# EAGLE design LSM6DS3_Breakout (EAGLE 7.1.0)
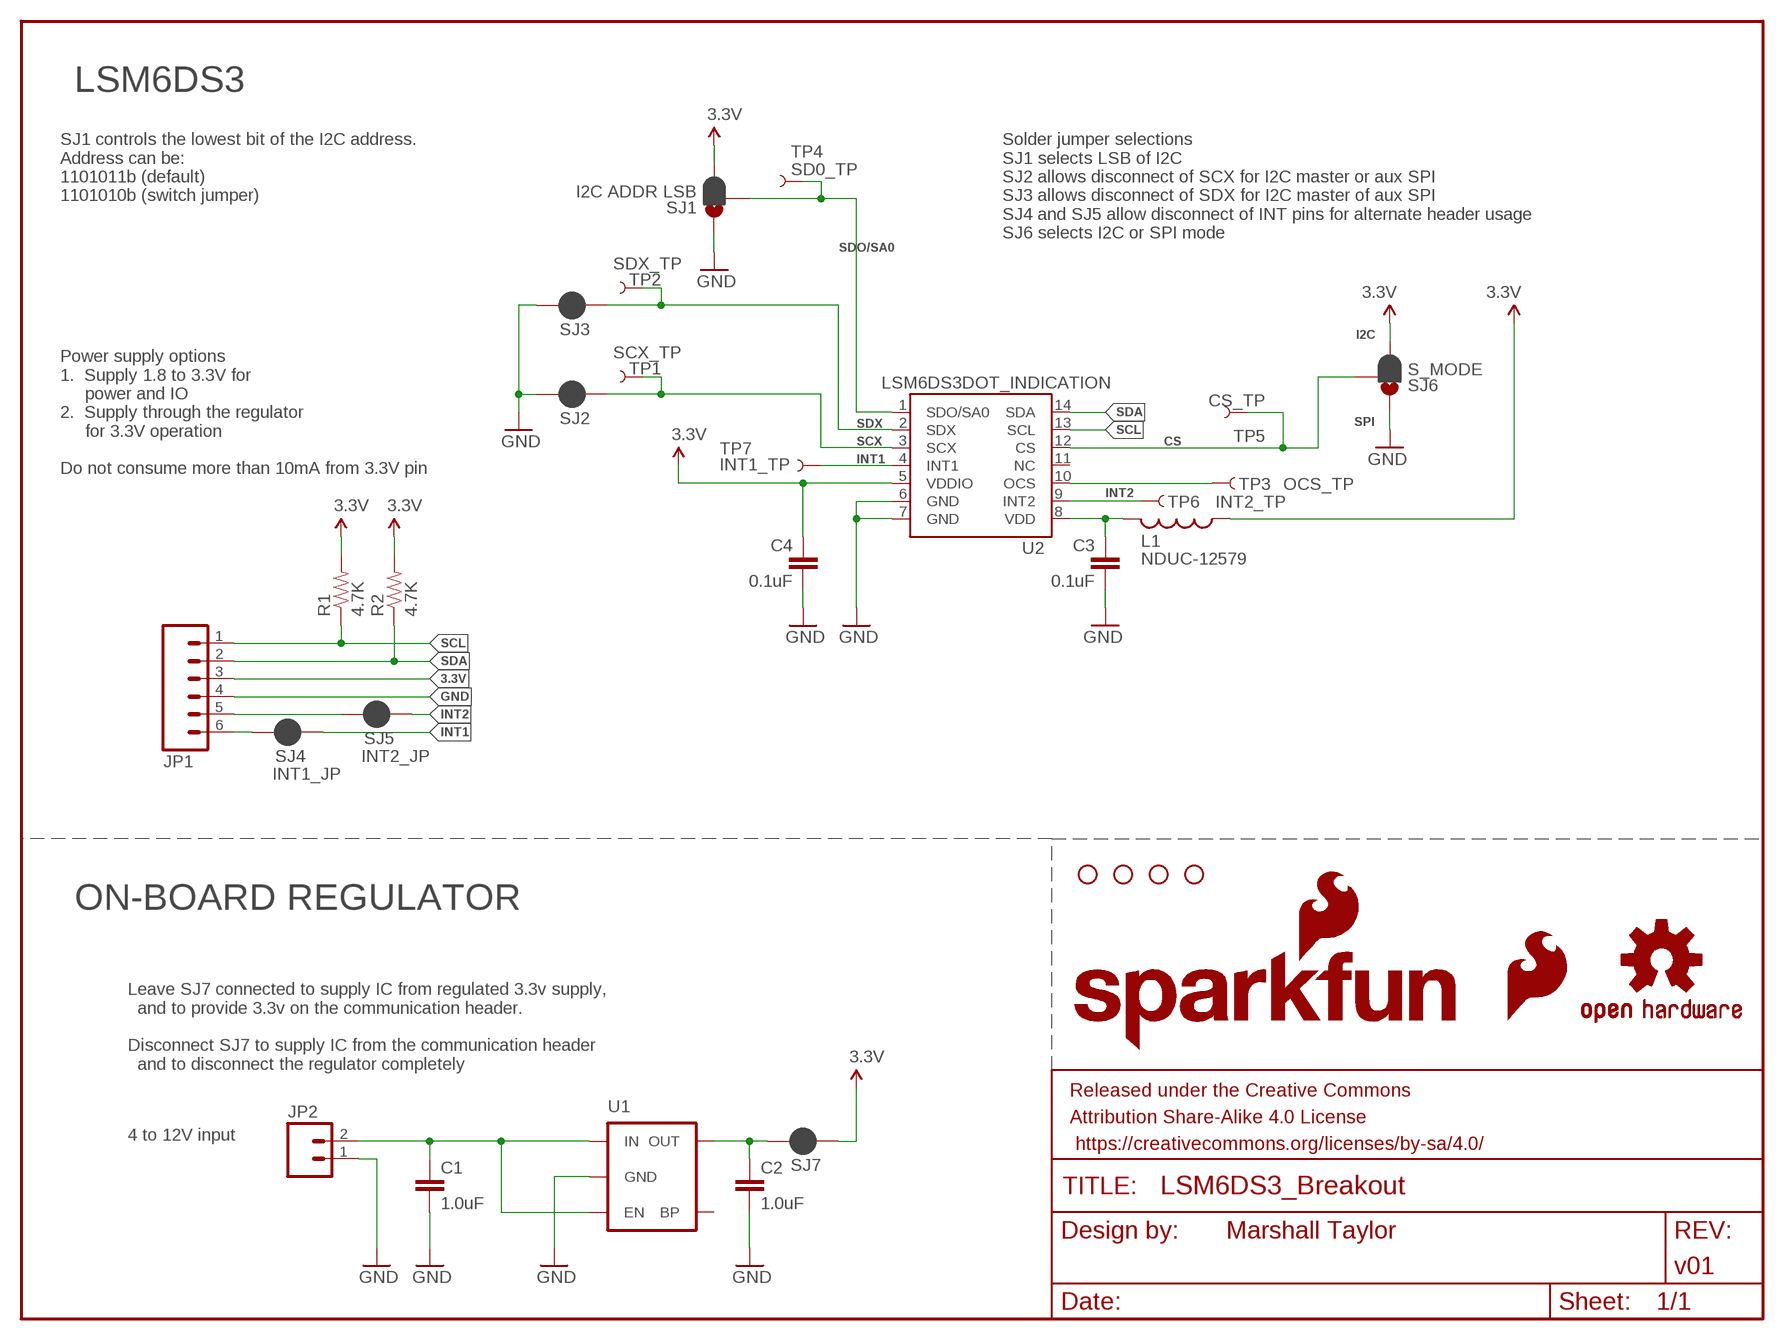
[diagram p0: schematic, sheet 1]

## Parts
C1  1.0uF  1.0UF-16V-10%(0603)  [0603-CAP]
C2  1.0uF  1.0UF-16V-10%(0603)  [0603-CAP]
C3  0.1uF  0.1UF-100V-10%(0603)  [0603-CAP]
C4  0.1uF  0.1UF-100V-10%(0603)  [0603-CAP]
FRAME1  FRAME-LETTER  [CREATIVE_COMMONS]
JP1  M06SILK_FEMALE_PTH  [1X06]
JP2  M02PTH  [1X02]
L1  NDUC-12579  INDUCTOR0603  [0603]
LOGO1  SFE_LOGO_NAME_FLAME.1_INCH  [SFE_LOGO_NAME_FLAME_.1]
LOGO2  OSHW-LOGOS  [OSHW-LOGO-S]
LOGO3  SFE_LOGO_FLAME.4_INCH  [SFE_LOGO_FLAME_.4]
R1  4.7K  4.7KOHM-1/10W-1%(0603)  [0603-RES]
R2  4.7K  4.7KOHM-1/10W-1%(0603)  [0603-RES]
SJ1  I2C ADDR LSB  JUMPER-PAD-3-2OF3_NC_BY_PASTE  [PAD-JUMPER-3-2OF3_NC_BY_PASTE_YES_SILK_FULL_BOX]
SJ2  JUMPER-PAD-2-NC_BY_PASTE  [PAD-JUMPER-2-NC_BY_PASTE_YES_SILK]
SJ3  JUMPER-PAD-2-NC_BY_PASTE  [PAD-JUMPER-2-NC_BY_PASTE_YES_SILK]
SJ4  INT1_JP  JUMPER-PAD-2-NC_BY_PASTE  [PAD-JUMPER-2-NC_BY_PASTE_YES_SILK]
SJ5  INT2_JP  JUMPER-PAD-2-NC_BY_PASTE  [PAD-JUMPER-2-NC_BY_PASTE_YES_SILK]
SJ6  S_MODE  JUMPER-PAD-3-2OF3_NC_BY_PASTE  [PAD-JUMPER-3-2OF3_NC_BY_PASTE_YES_SILK_FULL_BOX]
SJ7  JUMPER-PAD-2-NC_BY_PASTE  [PAD-JUMPER-2-NC_BY_PASTE_YES_SILK]
STANDOFF1  STAND-OFF  [STAND-OFF]
STANDOFF2  STAND-OFF  [STAND-OFF]
STANDOFF3  STAND-OFF  [STAND-OFF]
STANDOFF4  STAND-OFF  [STAND-OFF]
TP1  SCX_TP  TEST-POINTTP_15TH_THRU  [TP_15TH]
TP2  SDX_TP  TEST-POINTTP_15TH_THRU  [TP_15TH]
TP3  OCS_TP  TEST-POINTTP_15TH_THRU  [TP_15TH]
TP4  SD0_TP  TEST-POINTTP_15TH_THRU  [TP_15TH]
TP5  CS_TP  TEST-POINTTP_15TH_THRU  [TP_15TH]
TP6  INT2_TP  TEST-POINTTP_15TH_THRU  [TP_15TH]
TP7  INT1_TP  TEST-POINTTP_15TH_THRU  [TP_15TH]
U1  MIC52053.3V  [SOT23-5]
U2  LSM6DS3DOT_INDICATION  [LGA14L_DOT_INDICATOR]

## Nets
3.3V: C4.1 JP1.3 L1.1 R1.2 R2.2 SJ1.3 SJ6.3 SJ7.1 U2.5(VDDIO)
CS: SJ6.2 TP5.P$1 U2.12(CS)
GND: C1.2 C2.2 C3.2 C4.2 JP1.4 JP2.1 SJ1.1 SJ2.2 SJ3.2 SJ6.1 U1.2(GND) U2.6(GND) U2.7(GND)
INT1: SJ4.1 TP7.P$1 U2.4(INT1)
INT2: SJ5.1 TP6.P$1 U2.9(INT2)
N$1: C3.1 L1.2 U2.8(VDD)
N$2: TP3.P$1 U2.10(OCS)
N$3: JP1.5 SJ5.2
N$4: JP1.6 SJ4.2
N$5: C1.1 JP2.2 U1.1(IN) U1.3(EN)
N$6: C2.1 SJ7.2 U1.5(OUT)
SCL: JP1.1 R1.1 U2.13(SCL)
SCX: SJ2.1 TP1.P$1 U2.3(SCX)
SDA: JP1.2 R2.1 U2.14(SDA)
SDO/SA0: SJ1.2 TP4.P$1 U2.1(SDO/SA0)
SDX: SJ3.1 TP2.P$1 U2.2(SDX)
Unconnected: U1.4(BP) U2.11(NC)

## Notes on the sheet
- LSM6DS3
- SJ1 controls the lowest bit of the I2C address.
  Address can be:
  1101011b (default)
  1101010b (switch jumper)
- Solder jumper selections
  SJ1 selects LSB of I2C
  SJ2 allows disconnect of SCX for I2C master or aux SPI
  SJ3 allows disconnect of SDX for I2C master of aux SPI
  SJ4 and SJ5 allow disconnect of INT pins for alternate header usage
  SJ6 selects I2C or SPI mode
- I2C
- SPI
- Power supply options
  1.  Supply 1.8 to 3.3V for
       power and IO
  2.  Supply through the regulator
       for 3.3V operation
- Do not consume more than 10mA from 3.3V pin
- ON-BOARD REGULATOR
- Leave SJ7 connected to supply IC from regulated 3.3v supply,
    and to provide 3.3v on the communication header.
  
  Disconnect SJ7 to supply IC from the communication header
    and to disconnect the regulator completely
- 4 to 12V input

## Library data of the parts
C1 C2 = SparkFun-Capacitors:1.0UF-16V-10%(0603): CAP-00868; PROD_ID: CAP-00868
C3 C4 = SparkFun-Capacitors:0.1UF-100V-10%(0603): CAP-08390; PROD_ID: CAP-08390
FRAME1 = SparkFun-Aesthetics:FRAME-LETTER: Schematic Frame Standard 8.5x11 US Letter frame; DESIGNER: Marshall Taylor; VERSION: v01
JP1 = SparkFun-Connectors:M06: Header 6 Standard 6-pin 0.1" header. Use with straight break away headers (SKU : PRT-00116), right angle break away headers (PRT-00553), swiss pins (PRT-00743), machine pins (PRT-00117), and female headers (PRT-00115). Molex polarized connector foot print use with SKU : PRT-08094 with associated crimp pins and housings. NOTES ON THE VARIANTS LOCK and LOCK_LONGPADS... This footprint was designed to help hold the alignment of a through-hole component (i.e. 6-pin header) while soldering it into place. You may notice that each hole has been shifted either up or down by 0.005 of an inch from it's more standard position (which is a perfectly straight line). This slight alteration caused the pins (the squares in the middle) to touch the edges of the holes. Because they are alternating, it causes a "brace" to hold the component in place. 0.005 has proven to be the perfect amount of "off-center" position when using our standard breakaway headers. Although looks a little odd when you look at the bare footprint, once you have a header in there, the alteration is very hard to notice. Also,if you push a header all the way into place, it is covered up entirely on the bottom side. This idea of altering the position of holes to aid alignment will be further integrated into the Sparkfun Library for other footprints. It can help hold any component with 3 or more connection pins.; PROD_ID: CONN-08437
JP2 = SparkFun-Connectors:M02: Standard 2-pin 0.1" header. Use with - straight break away headers ( PRT-00116) - right angle break away headers (PRT-00553) - swiss pins (PRT-00743) - machine pins (PRT-00117) - female headers (PRT-00115) Molex polarized connector foot print use with: PRT-08233 with associated crimp pins and housings. 2.54_SCREWTERM for use with PRT-10571. 3.5mm Screw Terminal footprints for PRT-08084 5mm Screw Terminal footprints for use with PRT-08432
L1 = SparkFun-Passives:INDUCTOR: Inductors Basic Inductor/Choke - 0603 and 1206. Footprints are not proven and vary greatly between part numbers. SRN6045- 33uH, 20% 1.4A SDR0403-560KL - 56uH, 10%, 500mA RMS/740mA peak
LOGO1 = SparkFun-Aesthetics:SFE_LOGO_NAME_FLAME: SFE Logo, name and flame This is the SparkFun full logo. The logo on the schematic will always be the same size; the package variant is the height of the flame part of the logo. Default layer for the logo on the board is tSilk.
LOGO2 = SparkFun-Aesthetics:OSHW-LOGO: Open Source Hardware Logo This logo indicates the piece of hardware it is found on incorporates a OSHW license and/or adheres to the definition of open source hardware found here: http://freedomdefined.org/OSHW
LOGO3 = SparkFun-Aesthetics:SFE_LOGO_FLAME: SFE Logo, flame only This is the SparkFun flame logo. The logo on the schematic will always be the same size; the package variant is the height of the flame. Default layer for the logo on the board is tSilk.
R1 R2 = SparkFun-Resistors:4.7KOHM-1/10W-1%(0603): RES-07857; PROD_ID: RES-07857
SJ1 SJ6 = SparkFun-Passives:JUMPER-PAD-3-2OF3_NC_BY_PASTE
SJ2-SJ5 SJ7 = SparkFun-Passives:JUMPER-PAD-2-NC_BY_PASTE
STANDOFF1-STANDOFF4 = SparkFun-Electromechanical:STAND-OFF: #4 Stand Off This is the mechanical footprint for a #4 phillips button head screw. Use the keepout ring to avoid running the screw head into surrounding components. SKU : PRT-00447
TP1-TP7 = SparkFun-Passives:TEST-POINT: Bare copper test points for troubleshooting or ICT
U1 = SparkFun-PowerIC:MIC5205: MIC5205 150mA vreg 3.3V - VREG-00822 5V - VREG-00823; PROD_ID: VREG-00822
U2 = LSM6DS3:LSM6DS3

## Board
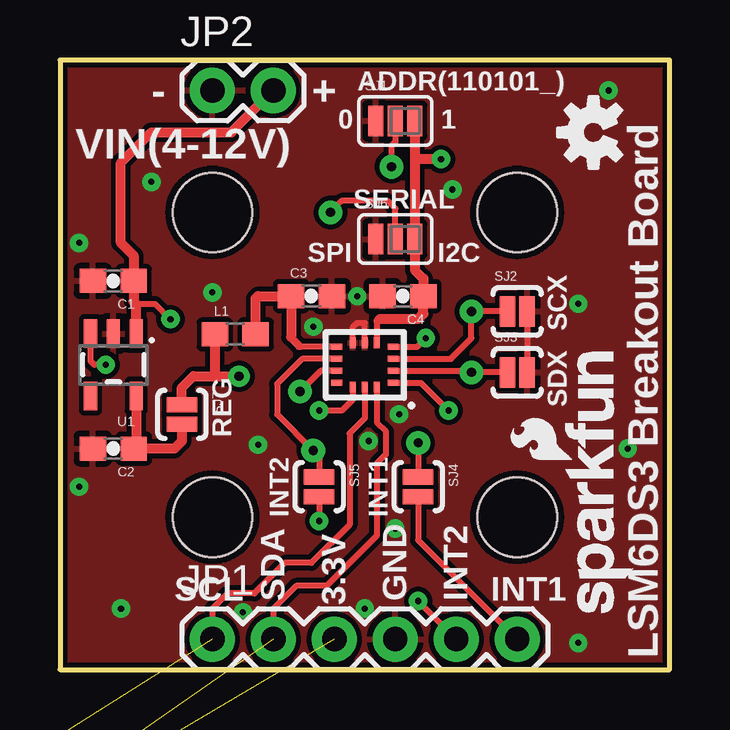
[diagram p1: board, top side]
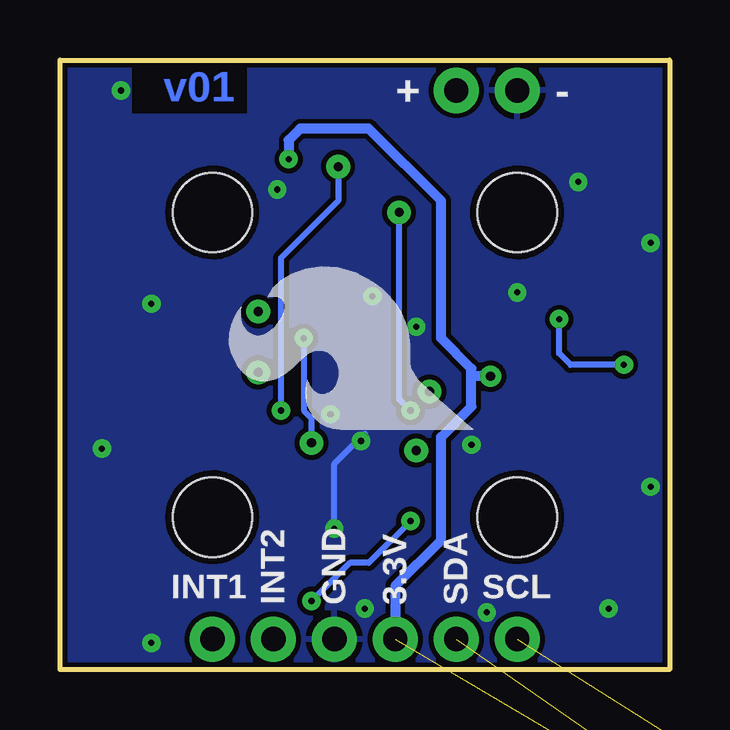
[diagram p2: board, bottom side, seen from below]

Size 25.4 x 25.4 mm. Coordinates in mm from the lower left corner, seen from the top.
Outline: 25.4,25.4 0,25.4 0,0 25.4,0 25.4,25.4
Copper layers (1*16): Top 0.035mm / dielectric 1.5mm / Bottom 0.035mm
Design rules "SparkFun-2-layer": minimum track width 7mil, minimum drill 15mil, track to track 8mil, track to pad 8mil, pad to pad 8mil, via to via 8mil, smd to smd 8mil, copper to edge 8mil, drill to drill 8mil, minimum pad ring 12mil, minimum via ring 10mil, stop-mask expansion 4mil, vias tented up to drill 20mil, thermal gap 10mil
bRestrict: area 17.6,23.2 to 22.4,25.4

### Footprints (pad centres in the part's own frame; a part is rotated, then mirrored left to right if it is on the bottom)
0603-CAP = smd 1.1 x 1: 1 -0.85,0; 2 0.85,0
1X06 = drill 1.016 pad 1.88: 1 0,0; 2 2.54,0; 3 5.08,0; 4 7.62,0; 5 10.16,0; 6 12.7,0
1X02 = drill 1.016 pad 1.88: 1 0,0; 2 2.54,0
0603 = smd 1.1 x 1: 1 -0.85,0; 2 0.85,0
0603-RES = smd 1.1 x 1: 1 -0.85,0; 2 0.85,0
PAD-JUMPER-3-2OF3_NC_BY_PASTE_YES_SILK_FULL_BOX = smd 0.635 x 1.27: 1 -0.813,0; 2 0,0; 3 0.813,0
PAD-JUMPER-2-NC_BY_PASTE_YES_SILK = smd 0.635 x 1.27: 1 -0.401,0; 2 0.413,0
STAND-OFF = hole 3.302: 0,0
TP_15TH = drill 0.381 pad 0.61: P$1 0,0
SOT23-5 = smd 0.55 x 1.2: 1 -0.95,-1.3; 2 0,-1.3; 3 0.95,-1.3; 4 0.95,1.3; 5 -0.95,1.3
LGA14L_DOT_INDICATOR = smd 0.45 x 0.25: 1 -1.175,0.75; 2 -1.175,0.25; 3 -1.175,-0.25; 4 -1.175,-0.75; 8 1.175,-0.75; 9 1.175,-0.25; 10 1.175,0.25; 11 1.175,0.75 | smd 0.25 x 0.45: 5 -0.5,-0.925; 6 0,-0.925; 7 0.5,-0.925; 12 0.5,0.925; 13 0,0.925; 14 -0.5,0.925

### Placement (x,y rotation side)
C1  2.22,16.19 180 top
C2  2.22,9.21 180 top
C3  10.48,15.56 0 top
C4  14.29,15.56 180 top
FRAME1  -24.13,-26.67 0 top  (outside the outline)
JP1  6.35,1.27 0 top
JP2  6.35,24.13 0 top
L1  7.3,13.97 0 top
LOGO1  23.97,1.91 90 top
LOGO2  22.23,22.38 90 top
LOGO3  7.62,9.37 90 bottom
R1  -43.18,-30.48 0 top  (outside the outline)
R2  -43.18,-35.56 0 top  (outside the outline)
SJ1  13.97,22.86 0 top
SJ2  19.05,14.92 0 top
SJ3  19.05,12.38 0 top
SJ4  14.92,7.62 270 top
SJ5  10.79,7.62 270 top
SJ6  13.97,17.94 0 top
SJ7  5.08,10.64 270 top
STANDOFF1  6.35,19.05 0 top
STANDOFF2  6.35,6.35 0 top
STANDOFF3  19.05,19.05 0 top
STANDOFF4  19.05,6.35 0 top
TP1  17.14,14.92 180 top
TP2  17.14,12.38 180 top
TP3  10,11.59 180 top
TP4  13.81,20.95 0 top
TP5  11.27,19.05 0 top
TP6  10.56,9.13 180 top
TP7  14.92,9.45 180 top
U1  2.22,12.7 180 top
U2  12.7,12.7 180 top

### Tracks (layer width: path | path; a pad name or v marks a point on that pad's centre or on a via)
3.3V  (via drill 0.25, 0.38)  (2 unrouted)
  Top 0.254: 13.2,14.47 13.34,14.61 | 13.2,14.47 U2.5 | 13.2,14.47 13.2,14.58 13.3,14.68 13.48,14.68 13.51,14.65
  Top 0.406: 13.34,14.61 14.92,14.61 15.14,14.82 C4.1 15.14,16.3 14.78,16.65 SJ6.3 14.78,21.27 | SJ1.3 14.78,21.27 | v15.88,21.27 14.78,21.27 | SJ7.1 5.08,11.75 5.56,12.22 6.51,12.22 | 6.51,12.22 v7.46,12.22 | L1.1 6.45,12.28 6.51,12.22
  Bottom 0.406: JP1.3 11.43,3.49 9.53,5.4 9.53,9.68 8.26,10.95 8.26,12.22 | v15.88,21.27 15.88,22.07 15.4,22.54 12.54,22.54 9.53,19.53 9.53,13.81 8.26,12.54 8.26,12.22 | v7.46,12.22 8.26,12.22
CS  (via drill 0.25)
  Top 0.254: U2.12 12.2,11.25 11.75,10.79 v10.79,10.79 | SJ6.2 13.97,19.21 13.65,19.53 11.75,19.53 TP5.P$1
  Bottom 0.254: v10.79,10.79 11.27,11.27 TP5.P$1
GND  (via drill 0.25)
  Top 0.254: SJ2.2 SJ3.2 | U2.6 12.7,14.45 12.38,14.45 12.2,14.26 U2.7
  Bottom 0.254: v13.97,5.87 13.97,8.57 12.7,9.84
  other vias: 12.86,9.53 7.62,2.38 14.13,10.64 12.38,15.56 0.79,7.62 16.35,20 22.86,24.13 21.59,1.11 21.59,15.24 12.7,2.54 3.81,20.32 6.35,15.72 8.26,9.37 2.54,2.54 10.56,14.29 23.65,9.21 0.79,17.78
  pour Bottom: 25.4,0 25.4,25.4 0,25.4 0,0
  pour Top: 25.4,0 25.4,25.4 0,25.4 0,0
INT1  (via drill 0.25)
  Top 0.254: U2.4 14.88,13.45 v15.24,13.81 | TP7.P$1 SJ4.1
  Bottom 0.254: v15.24,13.81 15.24,10.79 14.92,10.48 TP7.P$1
INT2
  Top 0.254: U2.9 10.09,12.95 9.05,11.91 9.05,10.64 TP6.P$1 10.79,8.89 SJ5.1
N$1
  Top 0.254: U2.8 10.04,13.45 | 9.63,13.87 10.04,13.45 | 10.04,13.45 9.97,13.45 | 9.97,13.45 9.6,13.81 | 9.97,13.45 9.94,13.45 9.55,13.84
  Top 0.406: 9.63,13.87 C3.1 8.26,15.56 8.15,15.46 L1.2
N$2
  Top 0.254: U2.10 10.86,12.45 TP3.P$1
N$3  (via drill 0.25)
  Top 0.254: SJ5.2 v10.79,6.19 | v14.92,2.86 JP1.5
  Bottom 0.254: v10.79,6.19 12.54,4.45 13.34,4.45 v14.92,2.86
N$4
  Top 0.254: SJ4.2 14.92,5.4 JP1.6
N$5  (via drill 0.25)
  Top 0.254: v1.91,12.7 1.43,12.7 1.27,12.86 U1.3 | 3.17,15.24 3.97,15.24 v4.6,14.61
  Top 0.406: JP2.2 7.14,22.38 3.81,22.38 2.54,21.11 2.54,17.78 3.07,17.25 C1.1 3.07,15.34 3.17,15.24 U1.1
  Bottom 0.254: v1.91,12.7 4.13,12.7 4.6,13.18 v4.6,14.61
N$6
  Top 0.406: U1.5 3.17,9.36 3.07,9.26 C2.1 4.76,9.21 5.08,9.53 SJ7.2
SCL  (1 unrouted)
  Top 0.254: U2.13 12.7,10.48 12.06,9.84 12.06,6.03 10.48,4.45 9.37,4.45 8.1,3.17 6.99,3.17 6.35,2.54 JP1.1
SCX
  Top 0.254: U2.3 16.28,12.95 17.14,13.81 TP1.P$1 SJ2.1
SDA  (1 unrouted)
  Top 0.254: U2.14 13.2,10.29 13.57,9.92 13.57,8.97 13.2,8.6 13.2,5.58 11.11,3.49 9.84,3.49 8.89,2.54 JP1.2
SDO/SA0  (via drill 0.25)
  Top 0.254: SJ1.2 13.97,21.99 13.81,21.83 TP4.P$1 | U2.1 15.04,11.95 v16.19,10.79
  Bottom 0.254: TP4.P$1 13.81,19.53 16.19,17.14 v16.19,10.79
SDX
  Top 0.254: U2.2 17.08,12.45 TP2.P$1 SJ3.1

### Text on the board
Bottom: v01
Dimension: Units in Inches
tPlace: ADDR(110101_) | - | + | 0 | 1 | VIN(4-12V) | SERIAL | SPI | I2C | SCX | SDX | REG | INT2 | INT1 | SCL | SDA | 3.3V | GND | INT2 | INT1 | LSM6DS3 Breakout Board
bPlace: - | + | SCL | INT1 | SDA | 3.3V | GND | INT2